# EAGLE design ov7670 (EAGLE 8.4.2)
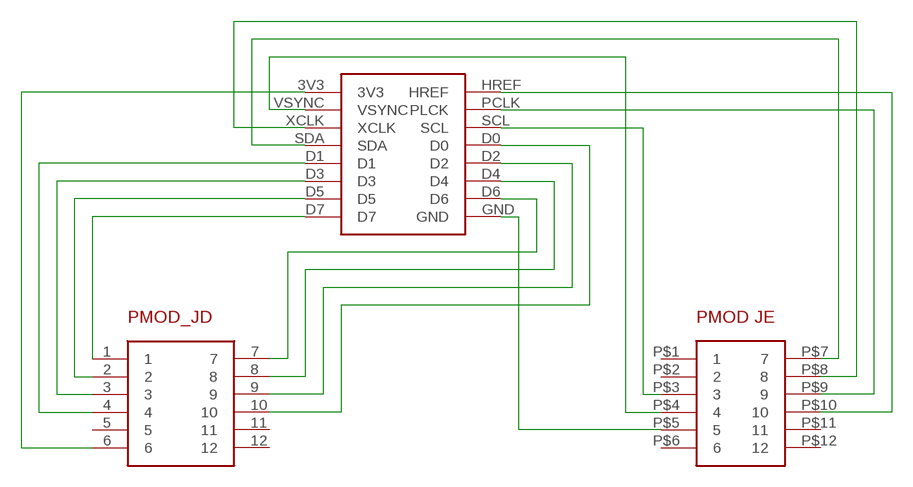
[diagram p0: schematic, sheet 1]

## Parts
D6  OV7670  [OV7670]
U$2  PMOD_JD  [PMOD_JD]
U$3  PMOD_JE  [PMOD_JE]

## Nets
3V3: D6.3V3 U$2.6
D0: D6.D0 U$2.10
D1: D6.D1 U$2.4
D2: D6.D2 U$2.9
D3: D6.D3 U$2.3
D4: D6.D4 U$2.8
D5: D6.D5 U$2.2
D7: D6.D7 U$2.1
GND: D6.GND U$3.P$5
HREF: D6.HREF U$3.P$10
N$6: D6.D6 U$2.7
PCLK: D6.PCLK(PLCK) U$3.P$9
SCL: D6.SCL U$3.P$3
SDA: D6.SDA U$3.P$7
VSYNC: D6.VSYNC U$3.P$4
XCLK: D6.XCLK U$3.P$8
Unconnected: U$2.5 U$2.11 U$2.12 U$3.P$1 U$3.P$2 U$3.P$6 U$3.P$11 U$3.P$12

## Library data of the parts
D6 = ov7670:OV7670
U$2 = ov7670:PMOD_JD
U$3 = ov7670:PMOD_JE

## Board
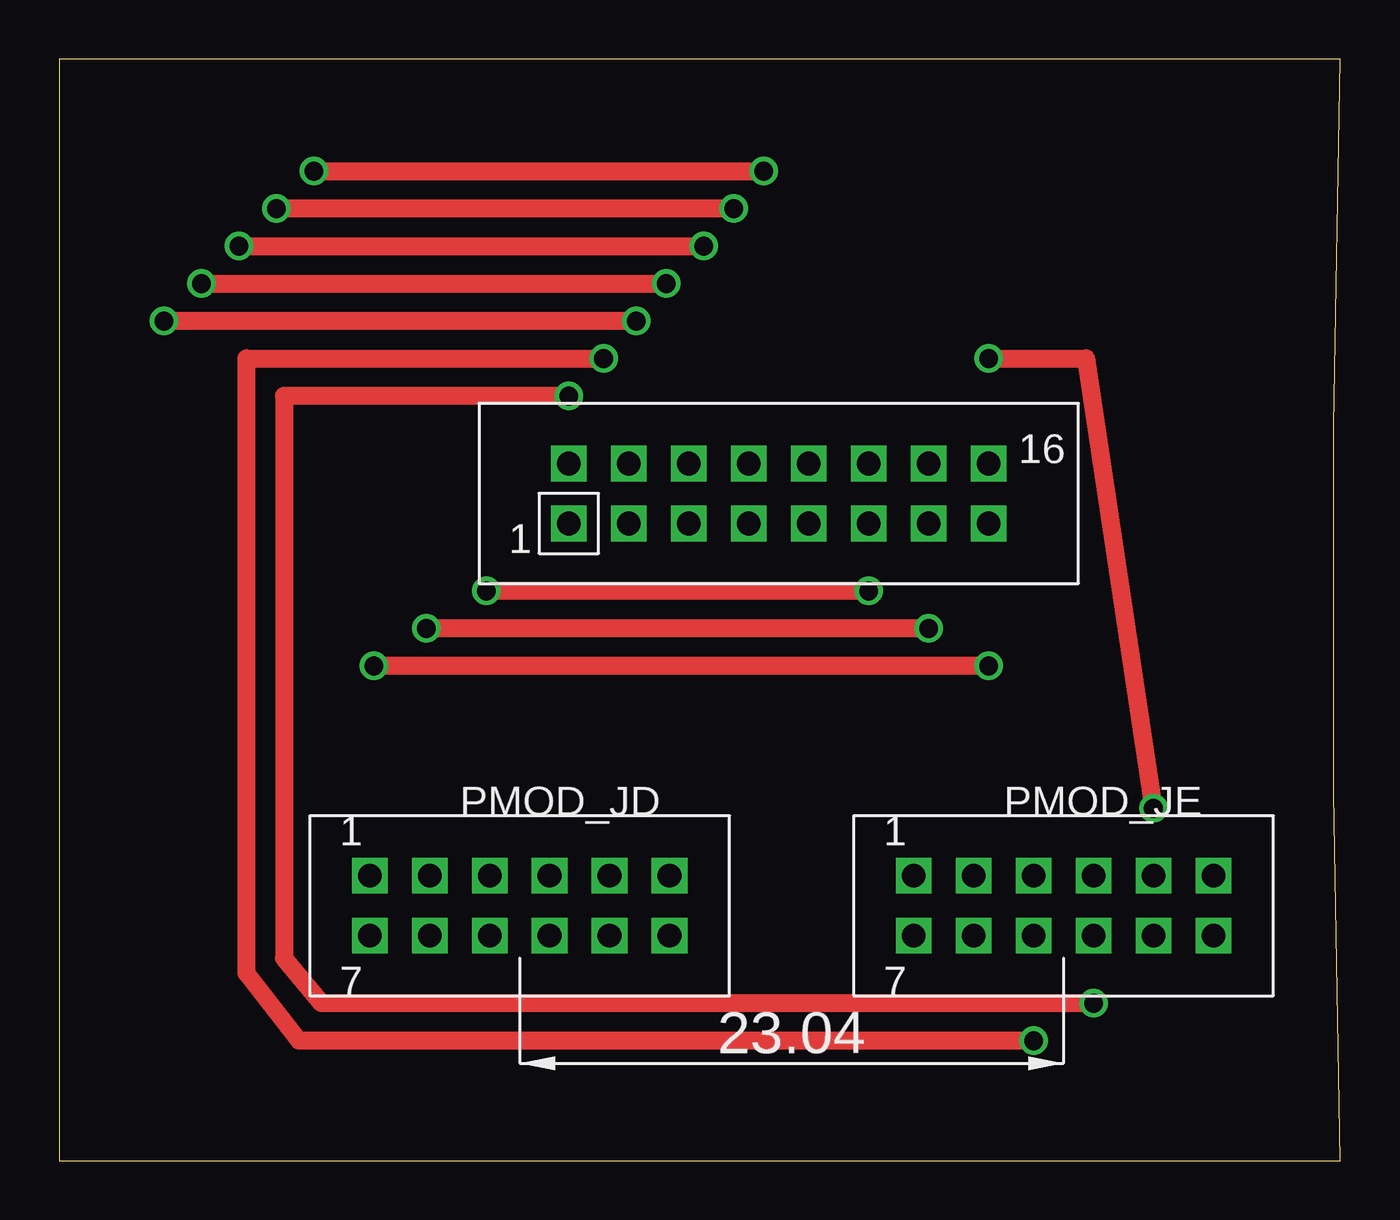
[diagram p1: board, top side]
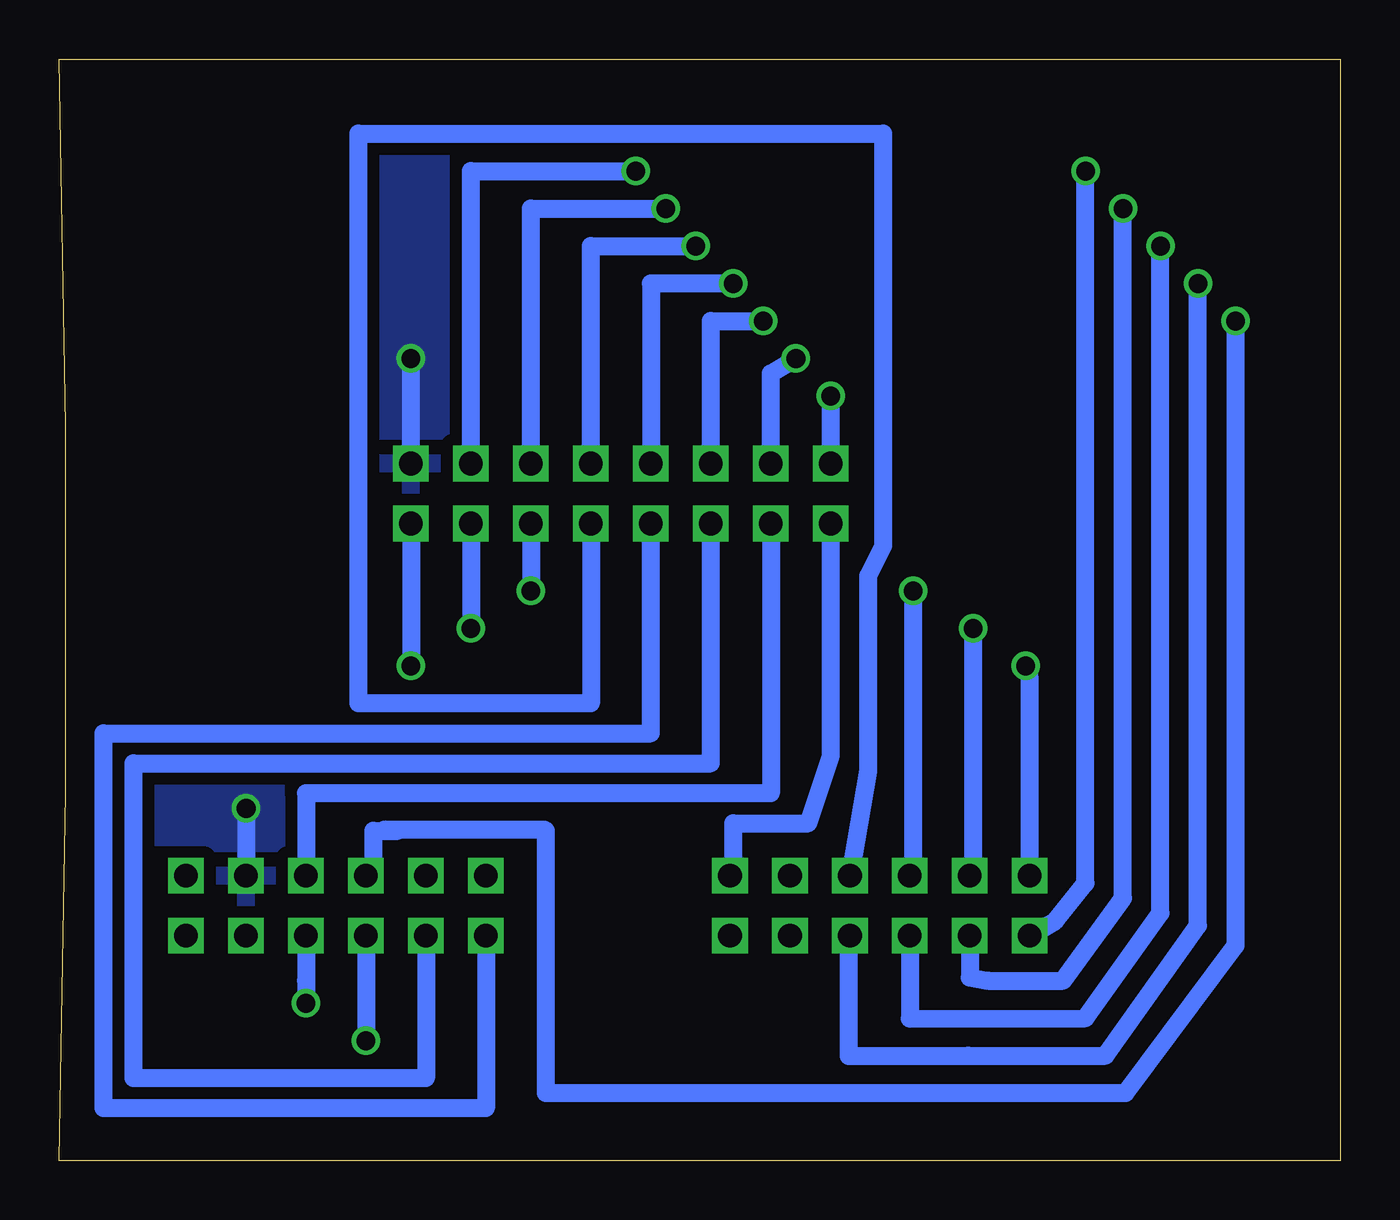
[diagram p2: board, bottom side, seen from below]

Size 54.27 x 46.66 mm. Coordinates in mm from the lower left corner, seen from the top.
Outline: 0,0 54.27,0 arc-3 54.27,46.66 0,46.66 0,0
Copper layers (1*16): Top 0.035mm / dielectric 1.5mm / Bottom 0.035mm
Design rules "default *": minimum track width 30mil, minimum drill 0.35mm, track to track 20mil, track to pad 20mil, pad to pad 20mil, via to via 20mil, smd to smd 20mil, copper to edge 20mil, drill to drill 6mil, minimum pad ring 10mil, minimum via ring 8mil, stop-mask expansion 4mil, vias tented up to drill 0mil, thermal gap 10mil

### Footprints (pad centres in the part's own frame; a part is rotated, then mirrored left to right if it is on the bottom)
OV7670 = drill 1 square: 3V3 -7.62,0; D0 0,2.54; D1 2.54,0; D2 2.54,2.54; D3 5.08,0; D4 5.08,2.54; D5 7.62,0; D6 7.62,2.54; D7 10.16,0; GND 10.16,2.54; HREF -7.62,2.54; PCLK -5.08,2.54; SCL -2.54,2.54; SDA 0,0; VSYNC -5.08,0; XCLK -2.54,0
PMOD_JD = drill 1 square: 1 -11.43,3.81; 2 -8.89,3.81; 3 -6.35,3.81; 4 -3.81,3.81; 5 -1.27,3.81; 6 1.27,3.81; 7 -11.43,1.27; 8 -8.89,1.27; 9 -6.35,1.27; 10 -3.81,1.27; 11 -1.27,1.27; 12 1.27,1.27
PMOD_JE = drill 1 square: P$1 -6.35,2.54; P$2 -3.81,2.54; P$3 -1.27,2.54; P$4 1.27,2.54; P$5 3.81,2.54; P$6 6.35,2.54; P$7 -6.35,0; P$8 -3.81,0; P$9 -1.27,0; P$10 1.27,0; P$11 3.81,0; P$12 6.35,0

### Placement (x,y rotation side)
D6  29.21,26.99 0 top
U$2  24.59,8.26 0 top
U$3  42.55,9.53 0 top

### Tracks (layer width: path | path; a pad name or v marks a point on that pad's centre or on a via)
3V3
  Bottom 0.762: D6.3V3 21.59,17.14 22.54,14.29 25.72,14.29 25.72,12.38 U$2.6
D0  (via drill 0.8)
  Top 0.762: v6.03,37.15 v25.72,37.15
  Bottom 0.762: U$2.10 20.83,8.63 20.83,4.43 15.77,4.45 9.95,4.45 6.03,9.95 v6.03,37.15 | D6.D0 29.21,37.15 v25.72,37.15
D1
  Bottom 0.762: D6.D1 31.75,19.37 41.59,19.37 41.59,43.5 19.37,43.5 19.37,26.04 20,24.77 20,16.51 U$2.4
D2  (via drill 0.8)
  Top 0.762: v7.62,38.73 v27.3,38.73
  Bottom 0.762: D6.D2 31.75,38.73 v27.3,38.73 | U$2.9 18.24,6.01 10.8,6.03 7.62,10.48 v7.62,38.73
D3  (via drill 0.8)
  Top 0.762: v34.29,24.13 v18.1,24.13
  Bottom 0.762: v18.1,24.13 18.1,12.24 U$2.3 | D6.D3 v34.29,24.13
D4  (via drill 0.8)
  Top 0.762: v28.58,40.32 v9.21,40.32
  Bottom 0.762: D6.D4 34.29,40.32 v28.58,40.32 | U$2.8 15.7,7.76 14.92,7.62 11.75,7.62 9.21,11.11 v9.21,40.32
D5  (via drill 0.8)
  Top 0.762: v36.83,22.54 v15.56,22.54
  Bottom 0.762: D6.D5 v36.83,22.54 | v15.56,22.54 15.56,12.24 U$2.2
D7  (via drill 0.8)
  Top 0.762: v39.37,20.95 v13.33,20.95
  Bottom 0.762: D6.D7 v39.37,20.95 | U$2.1 13.16,20.46 v13.33,20.95
GND  (via drill 0.8)
  Top 0.762: v39.37,33.97 43.5,33.97 v46.36,14.92
  Bottom 0.762: D6.GND v39.37,33.97 | v46.36,14.92 U$3.P$5
  pour Bottom: 53.98,0 0,0 0.32,0.32 0.32,46.67 0.64,46.35 53.98,46.35
  pour Bottom: 0.32,0 53.66,0 53.98,0.32 53.98,46.67 0.64,46.67 0,46.04 0,0.32
  pour Bottom: 54.29,0.32 0,0.32 0,46.35 53.66,46.35 53.98,46.04 53.98,0.64
HREF  (via drill 0.8)
  Top 0.762: v43.82,6.67 11.11,6.67 9.52,8.57 9.52,32.38 v21.59,32.38
  Bottom 0.762: D6.HREF v21.59,32.38 | U$3.P$10 43.81,7.62 v43.82,6.67
N$6  (via drill 0.8)
  Top 0.762: v10.8,41.91 v29.84,41.91
  Bottom 0.762: D6.D6 36.83,41.91 v29.84,41.91 | U$2.7 12.07,10.16 10.8,11.75 v10.8,41.91
PCLK  (via drill 0.8)
  Top 0.762: v41.27,5.08 10.16,5.08 7.94,7.94 7.94,33.97 v23.07,33.97
  Bottom 0.762: D6.PCLK 24.13,33.34 v23.07,33.97 | U$3.P$9 v41.27,5.08
SCL  (via drill 0.8)
  Top 0.762: v24.45,35.56 v4.44,35.56
  Bottom 0.762: U$3.P$3 40.96,12.38 40.96,13.97 39.91,13.97 40.49,14.03 33.71,14.03 33.66,13.97 33.66,2.86 9.11,2.86 4.44,9.11 v4.44,35.56 | D6.SCL 26.67,35.56 v24.45,35.56
SDA
  Bottom 0.762: D6.SDA 29.21,18.1 52.39,18.1 52.39,2.22 36.19,2.22 U$3.P$7
VSYNC
  Bottom 0.762: U$3.P$4 43.81,15.56 24.13,15.56 D6.VSYNC
XCLK
  Bottom 0.762: D6.XCLK 26.67,16.83 51.12,16.83 51.12,3.49 38.73,3.49 U$3.P$8